# Altium project TRACTIAN.PrjPcb
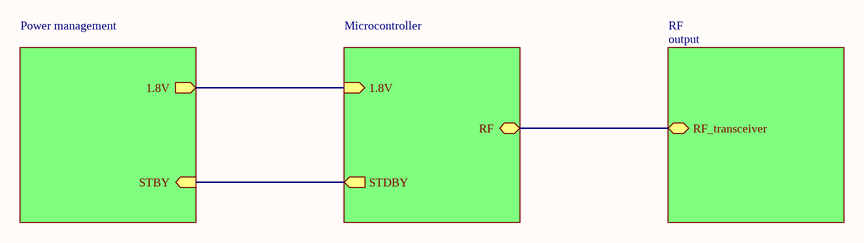
[diagram p0: Overview.SchDoc]
4 sheets, 68 parts. Net scope: hierarchical (ports join the sheet entries above them; power ports are global).
Board file: wifi.PcbDoc
Sheets:
  Overview.SchDoc
    Power management = power_management.SchDoc
    Microcontroller = microcontroller.SchDoc
    RF  = output.SchDoc

## Sheet Overview.SchDoc
size A

### Sub-sheets
Microcontroller = microcontroller: RF (bidir), 1.8V (in), STDBY (out)
Power management = power_management: 1.8V (out), STBY (in)
RF  = output: RF_transceiver (bidir)

### Nets
1.8V: sheet Power management/1.8V, sheet Microcontroller/1.8V
NetFL1_1: sheet Microcontroller/RF, sheet RF /RF_transceiver
NetIC1_6: sheet Power management/STBY, sheet Microcontroller/STDBY

## Sheet power_management.SchDoc
size A2
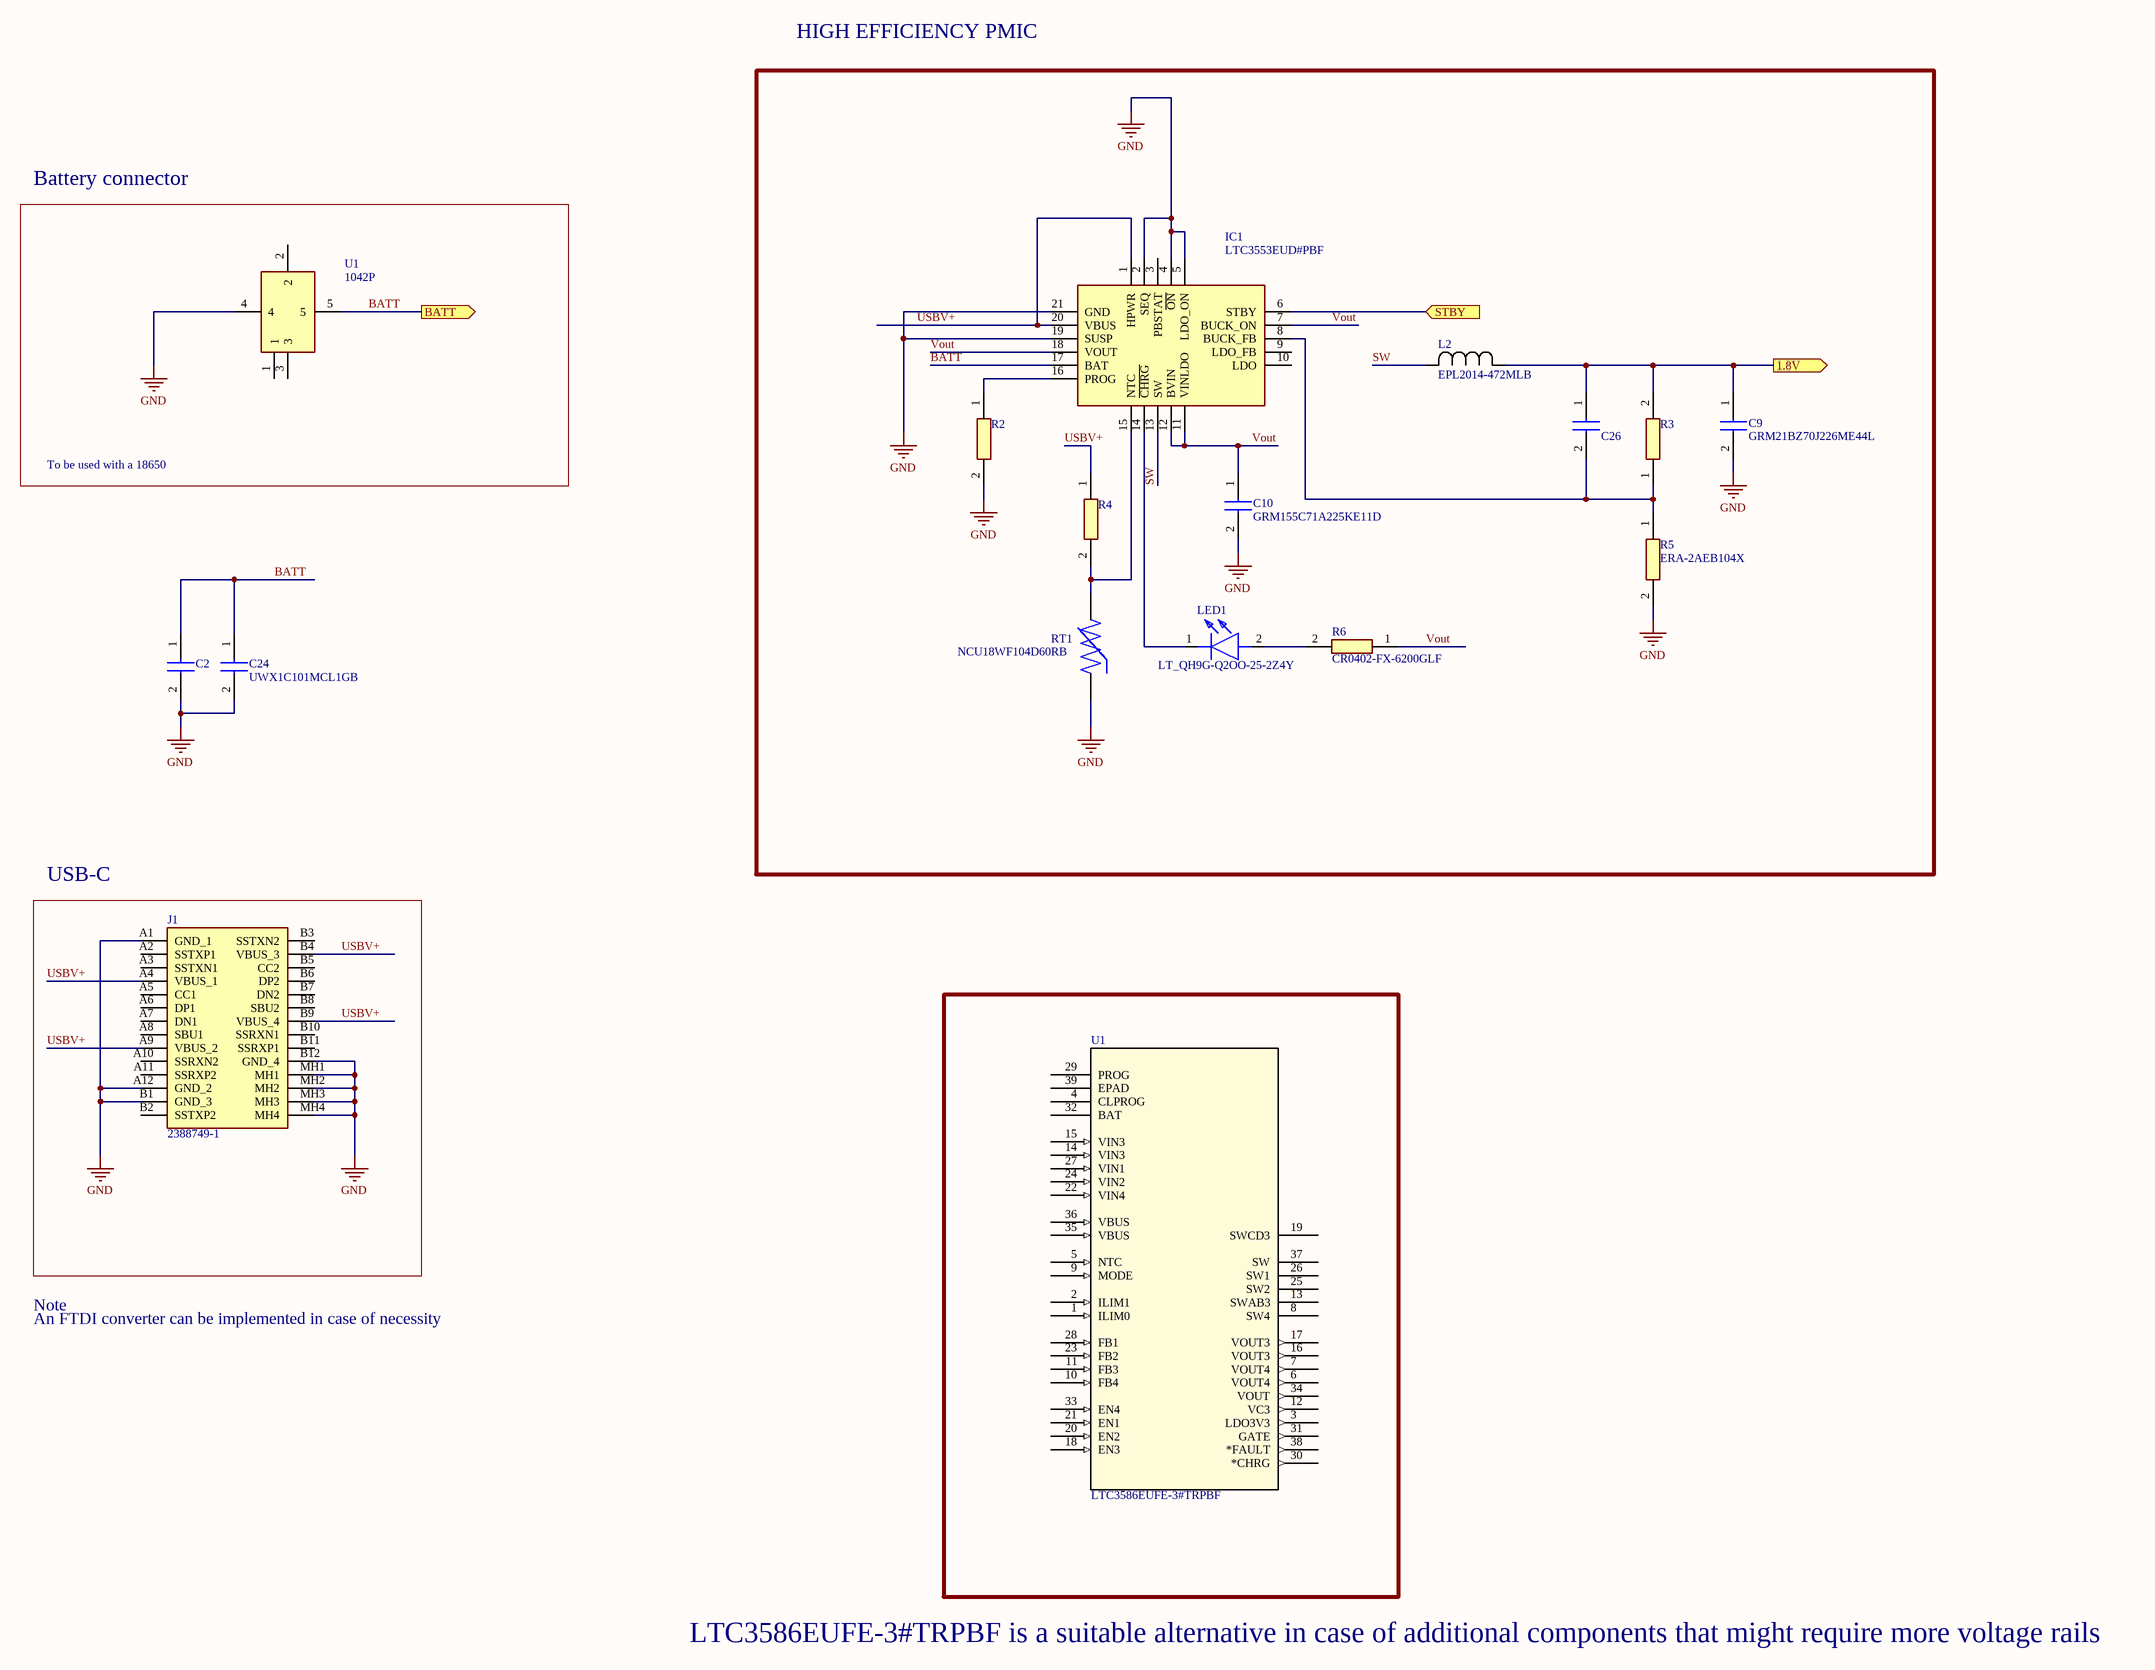
[diagram p1: power_management.SchDoc]

### Parts
(Parts that share a designator on the sheet are numbered #1, #2 ... from top to bottom, then left to right.)
C2  UWX1C101MCL1GB  [WX(6.3)]  (value not drawn)
C9  GRM21BZ70J226ME44L  [CAPC2012X145N]
C10  GRM155C71A225KE11D  [CAPC1005X55N]
C24  UWX1C101MCL1GB  [WX(6.3)]
C26  GRM1555C1H100JA01D  [CAPC1005X55N]  (value not drawn)
IC1  LTC3553EUD#PBF  [QFN40P300X300X80-21N-D]
J1  2388749-1  [23887491]
L2  EPL2014-472MLB  [IND_EPL2014-472MLB_COC]
LED1  LT_QH9G-Q2OO-25-2Z4Y  [LEDC1005X40N]
R2  CR0402-FX-3001GLF  [RESC1005X40N]  (value not drawn)
R3  CPF0402B130KE  [RESC1005X35N]  (value not drawn)
R4  ERJ-2RKF1003X  [ERJ2R_(0402)]  (value not drawn)
R5  ERA-2AEB104X  [ERA2AED122X]
R6  CR0402-FX-6200GLF  [RESC1005X40N]
RT1  NCU18WF104D60RB  [THRMC1608X95N]
U1#1  1042P  [1042P]
U1#2  LTC3586EUFE-3#TRPBF  [QFN-38_UFE_LIT]  (graphical)

### Blocks framed on the sheet
Battery connector: U1#1
USB-C: J1

### Ports
1.8V (out), BATT (out), STBY (in)

### Nets
GND: C2.2(+) C9.2 C10.2 C24.2(+) IC1.2(SEQ) IC1.4(~{ON}) IC1.5(LDO_ON) IC1.19(SUSP) IC1.21(GND) J1.A1(GND_1) J1.A12(GND_2) J1.B1(GND_3) J1.B12(GND_4) J1.MH1 J1.MH2 J1.MH3 J1.MH4 R2.2 R5.2 RT1.1 U1#1.4
1.8V: C9.1 C26.1 L2.1 R3.2 ; port 1.8V
BATT: C2.1(-) C24.1(-) IC1.17(BAT) U1#1.5 ; port BATT
SW: IC1.13(SW) L2.2
USBV+: IC1.1(HPWR) IC1.20(VBUS) J1.A4(VBUS_1) J1.A9(VBUS_2) J1.B4(VBUS_3) J1.B9(VBUS_4) R4.1
Vout: C10.1 IC1.7(BUCK_ON) IC1.11(VINLDO) IC1.12(BVIN) IC1.18(VOUT) R6.1
NetC26_2: C26.2 IC1.8(BUCK_FB) R3.1 R5.1
NetIC1_6: IC1.6(STBY) ; port STBY
NetIC1_14: IC1.14(~{CHRG}) LED1.1(K)
NetIC1_15: IC1.15(NTC) R4.2 RT1.2
NetIC1_16: IC1.16(PROG) R2.1
NetLED1_2: LED1.2(A) R6.2

Not connected (* = marked no-connect by the designer): IC1 3(PBSTAT) 9(LDO_FB) 10(LDO); J1 A2(SSTXP1) A3(SSTXN1) A5(CC1) A6(DP1) A7(DN1) A8(SBU1) A10(SSRXN2) A11(SSRXP2) B2(SSTXP2) B3(SSTXN2) B5(CC2) B6(DP2) B7(DN2) B8(SBU2) B10(SSRXN1) B11(SSRXP1); U1#1 1 2 3; U1#2 1(ILIM0) 2(ILIM1) 3(LDO3V3) 4(CLPROG) 5(NTC) 6(VOUT4) 7(VOUT4) 8(SW4) 9(MODE) 10(FB4) 11(FB3) 12(VC3) 13(SWAB3) 14(VIN3) 15(VIN3) 16(VOUT3) 17(VOUT3) 18(EN3) 19(SWCD3) 20(EN2) 21(EN1) 22(VIN4) 23(FB2) 24(VIN2) 25(SW2) 26(SW1) 27(VIN1) 28(FB1) 29(PROG) 30(*CHRG) 31(GATE) 32(BAT) 33(EN4) 34(VOUT) 35(VBUS) 36(VBUS) 37(SW) 38(*FAULT) 39(EPAD)

### Notes on the sheet
- HIGH EFFICIENCY PMIC
- To be used with a 18650
- An FTDI converter can be implemented in case of necessity
- Note
- LTC3586EUFE-3#TRPBF is a suitable alternative in case of additional components that might require more voltage rails
- Title
- Size:
- Date:
- File:
- A2
- Number:
- Time:
- Revision:
- Sheet
- of

### Library data of the parts
C2 C24 = UWX1C101MCL1GB: Capacitor; Manufacturer_Name: Nichicon; Datasheet Link: https://componentsearchengine.com/Datasheets/2/UWX1C101MCL1GB.pdf; Manufacturer_Part_Number: UWX1C101MCL1GB; Mouser Part Number: 647-UWX1C101MCL1; Mouser Price/Stock: https://www.mouser.co.uk/ProductDetail/Nichicon/UWX1C101MCL1GB?qs=7D1LtPJG0i2nFwCSiru1OQ%3D%3D; Arrow Part Number: UWX1C101MCL1GB; Arrow Price/Stock: https://www.arrow.com/en/products/uwx1c101mcl1gb/nichicon?region=nac
C9 = GRM21BZ70J226ME44L: Capacitor; Manufacturer_Name: Murata Electronics; Datasheet Link: https://datasheet.datasheetarchive.com/originals/distributors/Datasheets_SAMA/f9f842f388215b641c6ec7ec92c93a8d.pdf; Height: 1.45mm; Manufacturer_Part_Number: GRM21BZ70J226ME44L; Mouser Part Number: 81-GRM21BZ70J226ME4L; Mouser Price/Stock: https://www.mouser.co.uk/ProductDetail/Murata-Electronics/GRM21BZ70J226ME44L?qs=gt1LBUVyoHk1niSPiXLfGQ%3D%3D; Arrow Part Number: GRM21BZ70J226ME44L; Arrow Price/Stock: https://www.arrow.com/en/products/grm21bz70j226me44l/murata-manufacturing?region=nac
C10 = GRM155C71A225KE11D: Capacitor; Manufacturer_Name: Murata Electronics; Datasheet Link: https://psearch.en.murata.com/capacitor/product/GRM155C71A225KE11%23.html; Height: 0.55mm; Manufacturer_Part_Number: GRM155C71A225KE11D; Mouser Part Number: 81-GRM155C71A225KE1D; Mouser Price/Stock: https://www.mouser.co.uk/ProductDetail/Murata-Electronics/GRM155C71A225KE11D?qs=hNud%2FORuBR1WTMd%2FnRwa3Q%3D%3D; Arrow Part Number: GRM155C71A225KE11D; Arrow Price/Stock: https://www.arrow.com/en/products/grm155c71a225ke11d/murata-manufacturing?region=nac
C26 = GRM1555C1H100JA01D: Capacitor; Manufacturer_Name: Murata Electronics; Datasheet Link: https://datasheet.datasheetarchive.com/originals/distributors/Datasheets_SAMA/ec4f1577dddcc7a13ddad897a28002d3.pdf; Height: 0.55mm; Manufacturer_Part_Number: GRM1555C1H100JA01D; Mouser Part Number: 81-GRM1555C1H100JA1D; Mouser Price/Stock: https://www.mouser.co.uk/ProductDetail/Murata-Electronics/GRM1555C1H100JA01D?qs=to8XolpOzrNUIL4CZ%252BkORA%3D%3D; Arrow Part Number: GRM1555C1H100JA01D; Arrow Price/Stock: https://www.arrow.com/en/products/grm1555c1h100ja01d/murata-manufacturing
IC1 = LTC3553EUD#PBF: Integrated Circuit; Manufacturer_Name: Analog Devices; Datasheet Link: https://www.mouser.com/datasheet/2/609/3553fc-1270248.pdf; Height: 0.8mm; Manufacturer_Part_Number: LTC3553EUD#PBF; Mouser Part Number: 584-LTC3553EUD#PBF; Mouser Price/Stock: https://www.mouser.co.uk/ProductDetail/Analog-Devices/LTC3553EUDPBF?qs=hVkxg5c3xu%252Bt8tpGZUg1fw%3D%3D; Arrow Part Number: LTC3553EUD#PBF; Arrow Price/Stock: https://www.arrow.com/en/products/ltc3553eudpbf/analog-devices
J1 = 2388749-1: Connector; Manufacturer_Name: TE Connectivity; Datasheet Link: https://www.mouser.de/datasheet/2/418/8/ENG_CD_2388749_1-2492255.pdf; Height: 3.29mm; Manufacturer_Part_Number: 2388749-1; Mouser Part Number: 571-2388749-1; Mouser Price/Stock: https://www.mouser.co.uk/ProductDetail/TE-Connectivity/2388749-1?qs=aP1CjGhiNiHDGRk0QZ2ZCg%3D%3D; Arrow Part Number: 2388749-1; Arrow Price/Stock: https://www.arrow.com/en/products/2388749-1/te-connectivity?region=europe
L2 = EPL2014-472MLB: No Description Available; Mfr_Name: Coilcraft; Type: DEV; Copyright: Copyright (C) 2022 Ultra Librarian. All rights reserved.; Manufacturer_Part_Number: EPL2014-472MLB; RefDes: RefDes
LED1 = LT_QH9G-Q2OO-25-2Z4Y: LED; Manufacturer_Name: OSRAM; Manufacturer_Part_Number: LT QH9G-Q2OO-25-2Z4Y; Datasheet Link: https://dammedia.osram.info/media/resource/hires/osram-dam-5171475/LT%20QH9G_EN.pdf; Height: 0.4mm; Mouser Part Number: 720-LTQH9GQ2S225; Mouser Price/Stock: https://www.mouser.co.uk/ProductDetail/OSRAM-Opto-Semiconductors/LT-QH9G-Q2OO-25-2Z4Y?qs=74fRo9GAWsyBNNbbi2bfww%3D%3D; Arrow Part Number: LT QH9G-Q2OO-25-2Z4Y; Arrow Price/Stock: https://www.arrow.com/en/products/ltqh9g-q2oo-25-2z4y/osram-opto-semiconductors
R2 = CR0402-FX-3001GLF: Resistor; Manufacturer_Name: Bourns; Datasheet Link: https://www.bourns.com/pdfs/CR0402.pdf; Height: 0.4mm; Manufacturer_Part_Number: CR0402-FX-3001GLF; Mouser Part Number: 652-CR0402FX-3001GLF; Mouser Price/Stock: https://www.mouser.co.uk/ProductDetail/Bourns/CR0402-FX-3001GLF?qs=SFHnMgm9IsyiPGXk%2Fs2PYg%3D%3D
R3 = CPF0402B130KE: Resistor; Manufacturer_Name: TE Connectivity; Datasheet Link: http://www.farnell.com/datasheets/1786775.pdf; Height: 0.35mm; Manufacturer_Part_Number: CPF0402B130KE; Mouser Part Number: 279-CPF0402B130KE; Mouser Price/Stock: https://www.mouser.com/Search/Refine.aspx?Keyword=279-CPF0402B130KE
R4 = ERJ-2RKF1003X: Resistor; Manufacturer_Name: Panasonic; Datasheet Link: http://industrial.panasonic.com/cdbs/www-data/pdf/RDA0000/AOA0000C304.pdf; Height: 0.4mm; Manufacturer_Part_Number: ERJ-2RKF1003X; Mouser Part Number: 667-ERJ-2RKF1003X; Mouser Price/Stock: https://www.mouser.co.uk/ProductDetail/Panasonic/ERJ-2RKF1003X?qs=H7k1u0Mp9JQnXoBKdf15Qg%3D%3D; Arrow Part Number: ERJ-2RKF1003X; Arrow Price/Stock: https://www.arrow.com/en/products/erj-2rkf1003x/panasonic?region=nac
R5 = ERA-2AEB104X: Resistor; Manufacturer_Name: Panasonic; Datasheet Link: http://industrial.panasonic.com/cdbs/www-data/pdf/RDM0000/AOA0000C307.pdf; Height: 0.4mm; Manufacturer_Part_Number: ERA-2AEB104X; Mouser Part Number: 667-ERA-2AEB104X; Mouser Price/Stock: https://www.mouser.co.uk/ProductDetail/Panasonic/ERA-2AEB104X?qs=YFwoyZoVY0jijibKYIWHHg%3D%3D; Arrow Part Number: ERA-2AEB104X; Arrow Price/Stock: https://www.arrow.com/en/products/era-2aeb104x/panasonic
R6 = CR0402-FX-6200GLF: Resistor; Manufacturer_Name: Bourns; Datasheet Link: https://www.bourns.com/pdfs/CR0402.pdf; Height: 0.4mm; Manufacturer_Part_Number: CR0402-FX-6200GLF; Mouser Part Number: 652-CR0402FX-6200GLF; Mouser Price/Stock: https://www.mouser.co.uk/ProductDetail/Bourns/CR0402-FX-6200GLF?qs=ePR1ZvdkOKK%252BzBZSL76wNw%3D%3D; Arrow Part Number: CR0402-FX-6200GLF; Arrow Price/Stock: https://www.arrow.com/en/products/cr0402-fx-6200glf/bourns?region=nac
RT1 = NCU18WF104D60RB: NTC Thermistor 100k 0603 (1608 Metric); MF: Murata; Package: 1608 Murata; MP: NCU18WF104D60RB; Check_prices: https://www.snapeda.com/parts/NCU18WF104D60RB/Murata/view-part/1297311/?ref=eda; Digi-Key_Part_Number: 490-18157-1-ND; Purchase-URL: https://pricing.snapeda.com/search/part/NCU18WF104D60RB/?ref=eda; Value: *; SnapEDA_Link: https://www.snapeda.com/parts/NCU18WF104D60RB/Murata/view-part/1297311/?ref=snap
U1#1 = 1042P: Undefined or Miscellaneous; Manufacturer_Name: Keystone Electronics; Datasheet Link: http://www.keyelco.com/product-pdf.cfm?p=13957; Height: 14mm; Manufacturer_Part_Number: 1042P; Mouser Part Number: 534-1042P; Mouser Price/Stock: https://www.mouser.co.uk/ProductDetail/Keystone-Electronics/1042P?qs=g2rIOKKlpoboHyq0g1zn1A%3D%3D; Arrow Part Number: 1042P; Arrow Price/Stock: https://www.arrow.com/en/products/1042p/keystone-electronics?region=europe
U1#2 = LTC3586EUFE-3#TRPBF: No Description Available; Mfr_Name: Analog Devices Inc; Copyright: Copyright (C) 2022 Ultra Librarian. All rights reserved.; Manufacturer_Part_Number: LTC3586EUFE-3#TRPBF; RefDes: RefDes; Type: DEV

## Sheet microcontroller.SchDoc
size A2
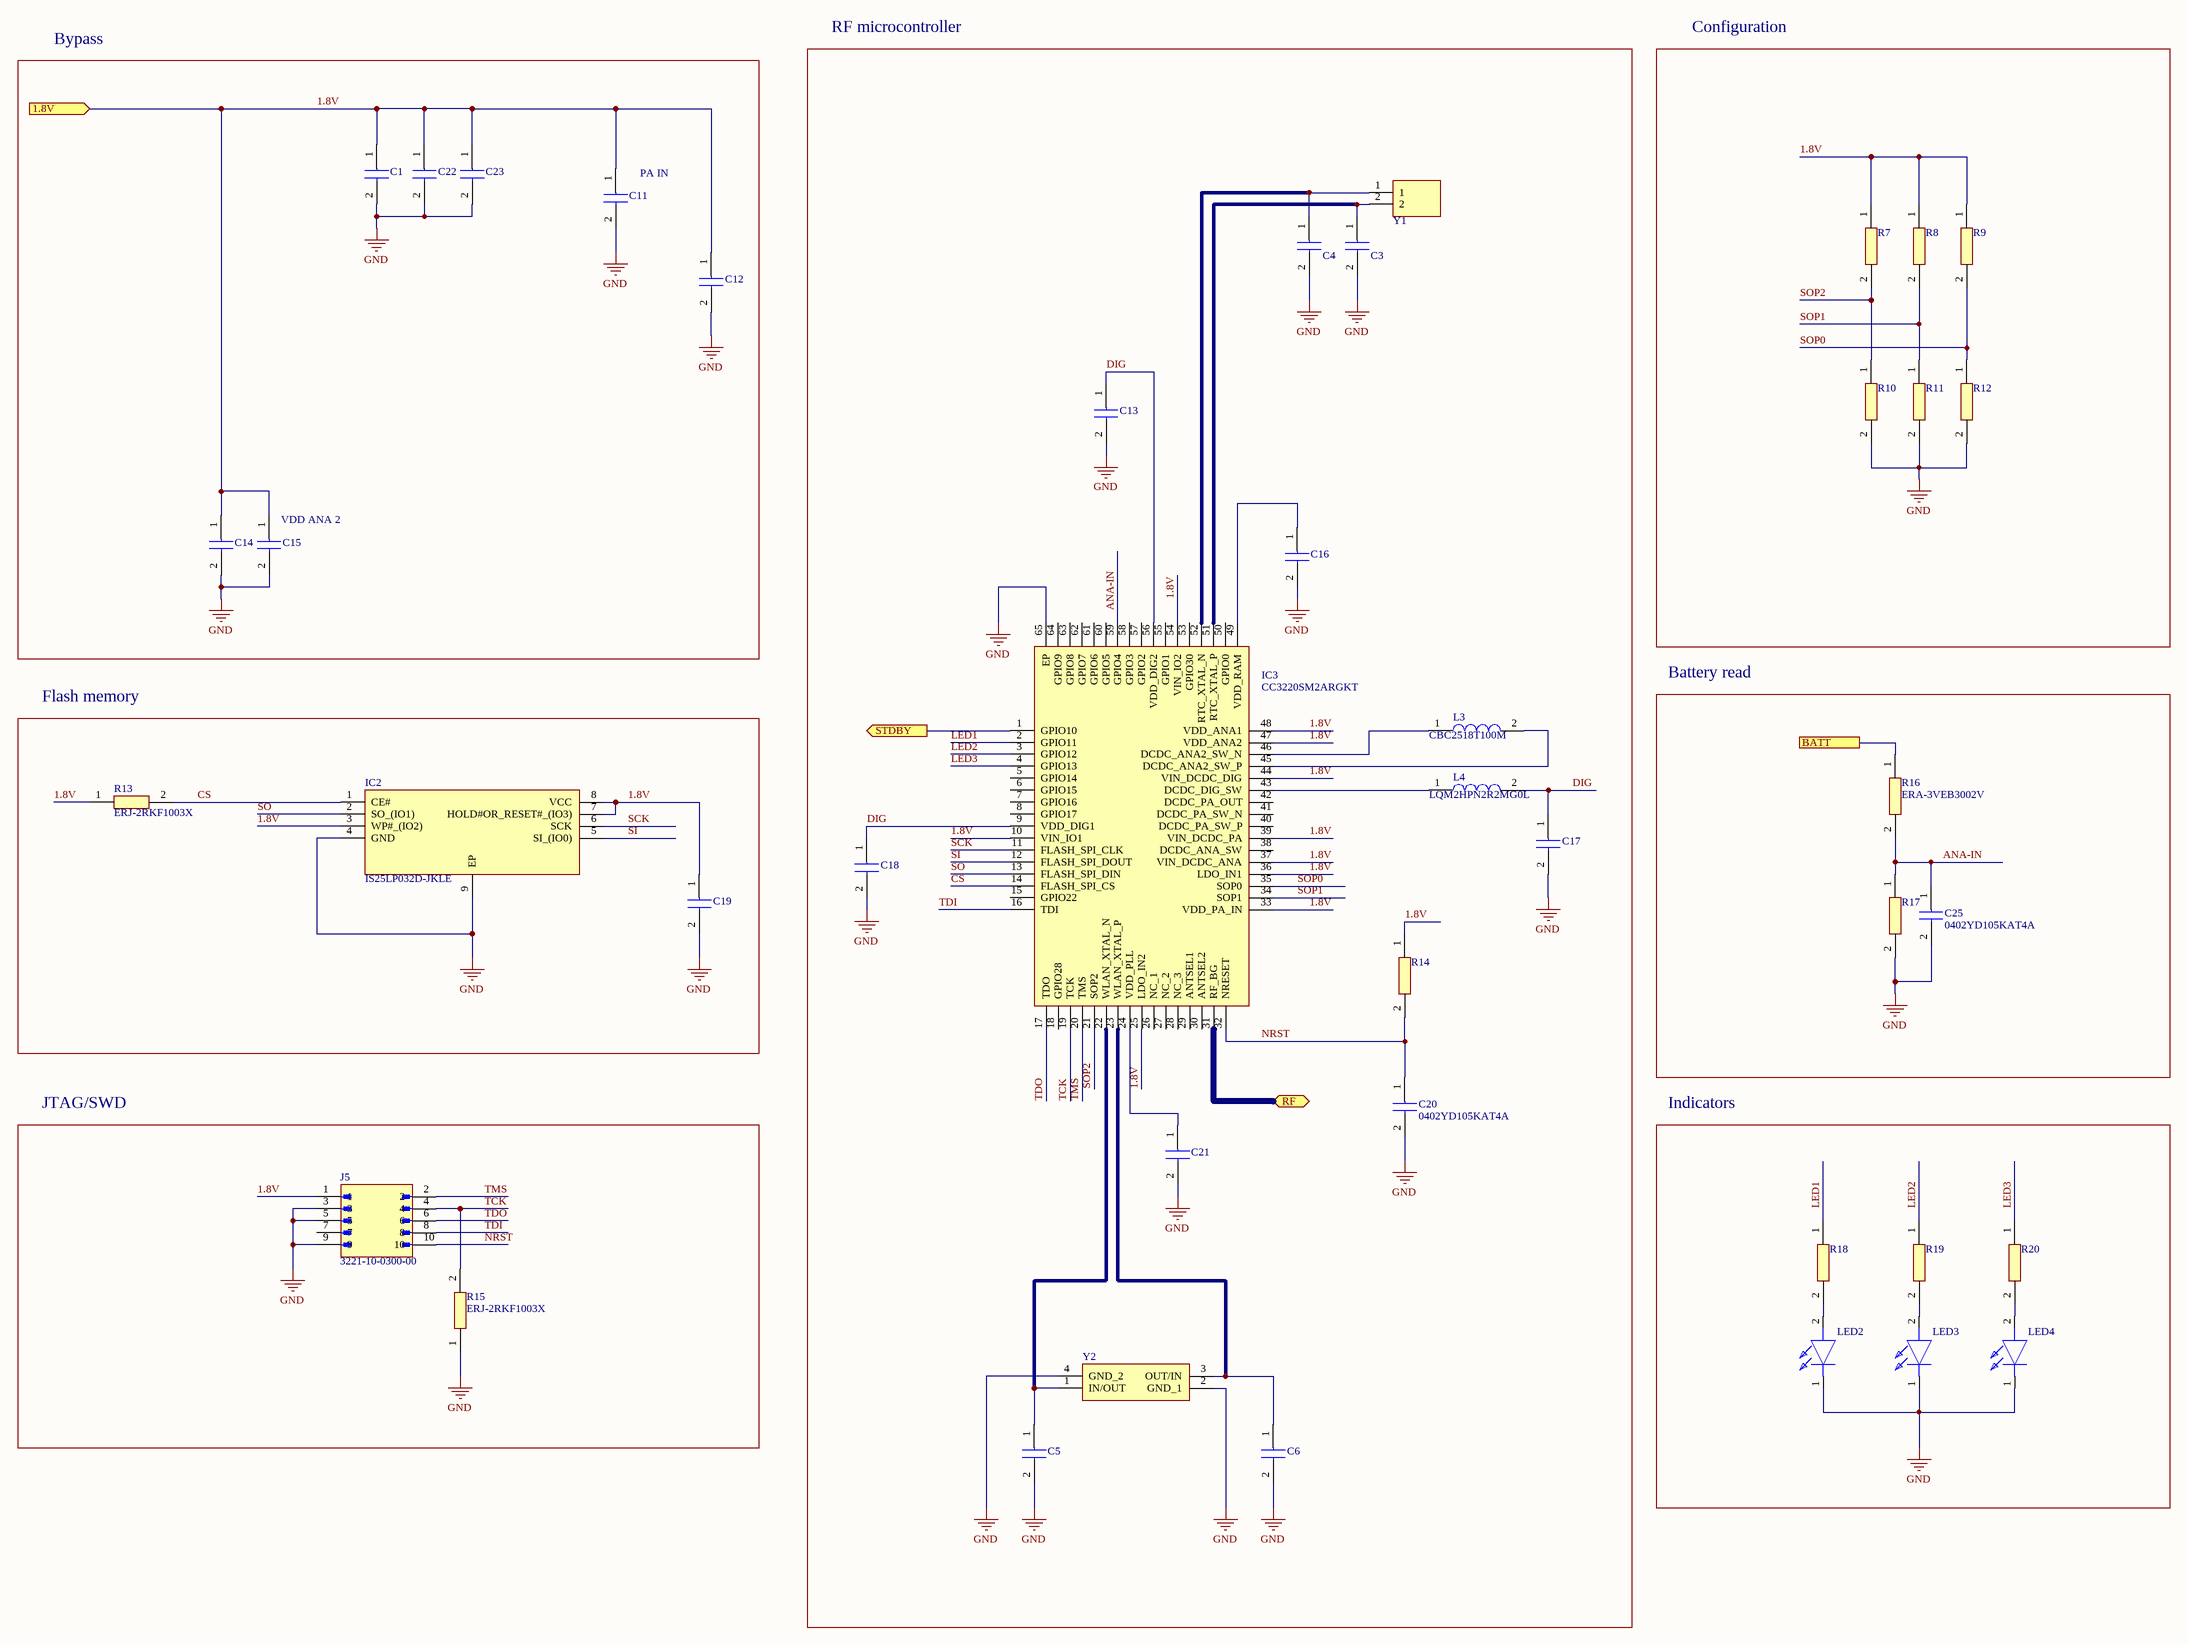
[diagram p2: microcontroller.SchDoc]

### Parts
C1  C1005X5R0J475M050BC  [C1005_Commercial]  (value not drawn)
C3  GRM1555C1H100JA01D  [CAPC1005X55N]  (value not drawn)
C4  GRM1555C1H100JA01D  [CAPC1005X55N]  (value not drawn)
C5  GRM1555C1H6R2CA01D  [CAPC1005X55N]  (value not drawn)
C6  GRM1555C1H6R2CA01D  [CAPC1005X55N]  (value not drawn)
C11  GRM158R60J226ME01D  [CAPC1005X80N]  (value not drawn)
C12  0402YD105KAT4A  [CAPC1005X56N]  (value not drawn)
C13  C1005X7R1C104K050BC  [C1005_Commercial]  (value not drawn)
C14  GRM155C80G106ME44D  [CAPC1005X55N]  (value not drawn)
C15  GRM155C80G106ME44D  [CAPC1005X55N]  (value not drawn)
C16  C1005X7R1C104K050BC  [C1005_Commercial]  (value not drawn)
C17  GRM155C80G106ME44D  [CAPC1005X55N]  (value not drawn)
C18  C1005X7R1C104K050BC  [C1005_Commercial]  (value not drawn)
C19  C1005X7R1C104K050BC  [C1005_Commercial]  (value not drawn)
C20  0402YD105KAT4A  [CAPC1005X56N]
C21  C1005X7R1C104K050BC  [C1005_Commercial]  (value not drawn)
C22  C1005X5R0J475M050BC  [C1005_Commercial]  (value not drawn)
C23  C1005X5R0J475M050BC  [C1005_Commercial]  (value not drawn)
C25  0402YD105KAT4A  [CAPC1005X56N]
IC2  IS25LP032D-JKLE  [SON127P600X500X80-9N-D]
IC3  CC3220SM2ARGKT  [QFN50P900X900X100-65N-D]
J5  3221-10-0300-00  [CNC_3221-10-0300-00]
L3  CBC2518T100M  [INDC2518X180N]
L4  LQM2HPN2R2MG0L  [INDC2520X100N]
LED2  LT_QH9G-Q2OO-25-2Z4Y  [LEDC1005X40N]  (value not drawn)
LED3  LT_QH9G-Q2OO-25-2Z4Y  [LEDC1005X40N]  (value not drawn)
LED4  LT_QH9G-Q2OO-25-2Z4Y  [LEDC1005X40N]  (value not drawn)
R7  ERJ-2RKF1003X  [ERJ2R_(0402)]  (value not drawn)
R8  ERJ-2RKF1003X  [ERJ2R_(0402)]  (value not drawn)
R9  ERJ-2RKF1003X  [ERJ2R_(0402)]  (value not drawn)
R10  ERJ-2RKF1003X  [ERJ2R_(0402)]  (value not drawn)
R11  ERJ-2RKF1003X  [ERJ2R_(0402)]  (value not drawn)
R12  ERJ-2RKF1003X  [ERJ2R_(0402)]  (value not drawn)
R13  ERJ-2RKF1003X  [ERJ2R_(0402)]
R14  ERJ-2RKF1003X  [ERJ2R_(0402)]  (value not drawn)
R15  ERJ-2RKF1003X  [ERJ2R_(0402)]
R16  ERA-3VEB3002V  [ERA3KV_(0603)]
R17  RT0603BRD0750KL  [RESC1608X55N]  (value not drawn)
R18  CR0402-FX-6200GLF  [RESC1005X40N]  (value not drawn)
R19  CR0402-FX-6200GLF  [RESC1005X40N]  (value not drawn)
R20  CR0402-FX-6200GLF  [RESC1005X40N]  (value not drawn)
Y1  ABS07-32.768KHZ-9-T  [ABS-07]  (value not drawn)
Y2  ECS-400-8-36B-7KY-TR  [ECS400836B7KYTR]  (value not drawn)

### Blocks framed on the sheet
Bypass: C1 C11 C12 C14 C15 C22 C23
RF microcontroller: C3-C6 C13 C16-C18 C20 C21 IC3 L3 L4 R14 Y1 Y2
Configuration: R7-R12
Battery read: C25 R16 R17
Flash memory: C19 IC2 R13
JTAG/SWD: J5 R15
Indicators: LED2-LED4 R18-R20

### Ports
1.8V (in), BATT, RF (bidir), STDBY (out)

### Nets
GND: C1.2 C3.2 C4.2 C5.2 C6.2 C11.2 C12.2 C13.2 C14.2 C15.2 C16.2 C17.2 C18.2 C19.2 C20.2 C21.2 C22.2 C23.2 C25.2 IC2.4(GND) IC2.9(EP) IC3.65(EP) J5.3 J5.5 J5.9 LED2.1(K) LED3.1(K) LED4.1(K) R10.2 R11.2 R12.2 R15.1 R17.2 Y2.2(GND_1) Y2.4(GND_2)
1.8V: C1.1 C11.1 C12.1 C14.1 C15.1 C19.1 C22.1 C23.1 IC2.3(WP#_(IO2)) IC2.7(HOLD#OR_RESET#_(IO3)) IC2.8(VCC) IC3.10(VIN_IO1) IC3.25(LDO_IN2) IC3.33(VDD_PA_IN) IC3.36(LDO_IN1) IC3.37(VIN_DCDC_ANA) IC3.39(VIN_DCDC_PA) IC3.44(VIN_DCDC_DIG) IC3.47(VDD_ANA2) IC3.48(VDD_ANA1) IC3.54(VIN_IO2) J5.1 R7.1 R8.1 R9.1 R13.1 R14.1 ; port 1.8V
ANA-IN: C25.1 IC3.59(GPIO4) R16.2 R17.1
CS: IC2.1(CE#) IC3.14(FLASH_SPI_CS) R13.2
DIG: C13.1 C17.1 C18.1 IC3.9(VDD_DIG1) IC3.56(VDD_DIG2) L4.2
LED1: IC3.2(GPIO11) R18.1
LED2: IC3.3(GPIO12) R19.1
LED3: IC3.4(GPIO13) R20.1
NRST: C20.1 IC3.32(NRESET) J5.10 R14.2
SCK: IC2.6(SCK) IC3.11(FLASH_SPI_CLK)
SI: IC2.5(SI_(IO0)) IC3.12(FLASH_SPI_DOUT)
SO: IC2.2(SO_(IO1)) IC3.13(FLASH_SPI_DIN)
SOP0: IC3.35(SOP0) R9.2 R12.1
SOP1: IC3.34(SOP1) R8.2 R11.1
SOP2: IC3.21(SOP2) R7.2 R10.1
TCK: IC3.19(TCK) J5.4 R15.2
TDI: IC3.16(TDI) J5.8
TDO: IC3.17(TDO) J5.6
TMS: IC3.20(TMS) J5.2
NetC3_1: C3.1 IC3.51(RTC_XTAL_P) Y1.2
NetC4_1: C4.1 IC3.52(RTC_XTAL_N) Y1.1
NetC5_1: C5.1 IC3.22(WLAN_XTAL_N) Y2.1(IN/OUT)
NetC6_1: C6.1 IC3.23(WLAN_XTAL_P) Y2.3(OUT/IN)
NetC16_1: C16.1 IC3.49(VDD_RAM)
NetC21_1: C21.1 IC3.24(VDD_PLL)
NetFL1_1: IC3.31(RF_BG) ; port RF
NetIC1_6: IC3.1(GPIO10) ; port STDBY
NetIC3_43: IC3.43(DCDC_DIG_SW) L4.1
NetIC3_45: IC3.45(DCDC_ANA2_SW_P) L3.2
NetIC3_46: IC3.46(DCDC_ANA2_SW_N) L3.1
NetLED2_2: LED2.2(A) R18.2
NetLED3_2: LED3.2(A) R19.2
NetLED4_2: LED4.2(A) R20.2
NetR16_1: R16.1 ; port BATT

Not connected (* = marked no-connect by the designer): IC3 5(GPIO14) 6(GPIO15) 7(GPIO16) 8(GPIO17) 15(GPIO22) 18(GPIO28) 26(NC_1) 27(NC_2) 28(NC_3) 29(ANTSEL1) 30(ANTSEL2) 38(DCDC_ANA_SW) 40(DCDC_PA_SW_P) 41(DCDC_PA_SW_N) 42(DCDC_PA_OUT) 50(GPIO0) 53(GPIO30) 55(GPIO1) 57(GPIO2) 58(GPIO3) 60(GPIO5) 61(GPIO6) 62(GPIO7) 63(GPIO8) 64(GPIO9); J5 7

### Notes on the sheet
- (near C11) PA IN
- (near C15) VDD ANA 2
- Title
- Size:
- Date:
- File:
- A2
- Number:
- Time:
- Revision:
- Sheet
- of

### Library data of the parts
C1 C22 C23 = C1005X5R0J475M050BC: Capacitor; Manufacturer_Name: TDK; Datasheet Link: https://product.tdk.com/system/files/dam/doc/product/capacitor/ceramic/mlcc/catalog/mlcc_commercial_general_en.pdf; Height: 0.55mm; Manufacturer_Part_Number: C1005X5R0J475M050BC; Mouser Part Number: 810-C1005X5R0J475M; Mouser Price/Stock: https://www.mouser.co.uk/ProductDetail/TDK/C1005X5R0J475M050BC?qs=NRhsANhppD%2Fq1XiyABABNQ%3D%3D; Arrow Part Number: C1005X5R0J475M050BC; Arrow Price/Stock: https://www.arrow.com/en/products/c1005x5r0j475m050bc/tdk
C3 C4 = GRM1555C1H100JA01D: as C26 on sheet power_management; Datasheet Link: https://datasheet.datasheetarchive.com/originals/distributors/Datasheets_SAMA/ec4f1577dddcc7a13ddad897a28002d3.pdf; Height: 0.55mm; Manufacturer_Part_Number: GRM1555C1H100JA01D; Mouser Part Number: 81-GRM1555C1H100JA1D; Mouser Price/Stock: https://www.mouser.co.uk/ProductDetail/Murata-Electronics/GRM1555C1H100JA01D?qs=to8XolpOzrNUIL4CZ%252BkORA%3D%3D; Arrow Part Number: GRM1555C1H100JA01D; Arrow Price/Stock: https://www.arrow.com/en/products/grm1555c1h100ja01d/murata-manufacturing
C5 C6 = GRM1555C1H6R2CA01D: Capacitor; Manufacturer_Name: Murata Electronics; Datasheet Link: https://datasheet.datasheetarchive.com/originals/distributors/Datasheets_SAMA/ec4f1577dddcc7a13ddad897a28002d3.pdf; Height: 0.55mm; Manufacturer_Part_Number: GRM1555C1H6R2CA01D; Mouser Part Number: 81-GRM1555C1H6R2CA1D; Mouser Price/Stock: https://www.mouser.co.uk/ProductDetail/Murata-Electronics/GRM1555C1H6R2CA01D?qs=e%252BE4OD6MgMdxw4b5lMPkpQ%3D%3D; Arrow Part Number: GRM1555C1H6R2CA01D; Arrow Price/Stock: https://www.arrow.com/en/products/grm1555c1h6r2ca01d/murata-manufacturing?region=nac
C11 = GRM158R60J226ME01D: Capacitor; Manufacturer_Name: Murata Electronics; Datasheet Link: https://search.murata.co.jp/Ceramy/image/img/A01X/G101/ENG/GRM158R60J226ME01-01A.pdf; Height: 0.8mm; Manufacturer_Part_Number: GRM158R60J226ME01D; Mouser Part Number: 81-GRM158R60J226ME1D; Mouser Price/Stock: https://www.mouser.co.uk/ProductDetail/Murata-Electronics/GRM158R60J226ME01D?qs=hd1VzrDQEGhRlVgN8RQ1oA%3D%3D; Arrow Part Number: GRM158R60J226ME01D; Arrow Price/Stock: https://www.arrow.com/en/products/grm158r60j226me01d/murata-manufacturing?region=europe
C12 C20 C25 = 0402YD105KAT4A: Capacitor; Manufacturer_Name: AVX; Datasheet Link: https://datasheet.datasheetarchive.com/originals/dk/DKDS40/DSANUWW008853.pdf; Height: 0.56mm; Manufacturer_Part_Number: 0402YD105KAT4A; Mouser Part Number: 581-0402YD105KAT4A; Mouser Price/Stock: https://www.mouser.co.uk/ProductDetail/AVX/0402YD105KAT4A?qs=mQP6vorrPAd40YYIeuHDNw%3D%3D
C13 C16 C18 C19 C21 = C1005X7R1C104K050BC: Capacitor; Manufacturer_Name: TDK; Datasheet Link: https://product.tdk.com/system/files/dam/doc/product/capacitor/ceramic/mlcc/catalog/mlcc_commercial_general_en.pdf; Height: 0.55mm; Manufacturer_Part_Number: C1005X7R1C104K050BC; Mouser Part Number: 810-C1005X7R1C104K; Mouser Price/Stock: https://www.mouser.co.uk/ProductDetail/TDK/C1005X7R1C104K050BC?qs=NRhsANhppD%252BhAGOapA8QKQ%3D%3D; Arrow Part Number: C1005X7R1C104K050BC; Arrow Price/Stock: https://www.arrow.com/en/products/c1005x7r1c104k050bc/tdk?region=nac
C14 C15 C17 = GRM155C80G106ME44D: Capacitor; Manufacturer_Name: Murata Electronics; Height: 0.55mm; Manufacturer_Part_Number: GRM155C80G106ME44D; Mouser Part Number: 81-GRM155C80G106ME44; Mouser Price/Stock: https://www.mouser.co.uk/ProductDetail/Murata-Electronics/GRM155C80G106ME44D?qs=T3oQrply3y9851rB85WA8A%3D%3D
IC2 = IS25LP032D-JKLE: Integrated Circuit; Manufacturer_Name: Integrated Silicon Solution Inc.; Datasheet Link: https://www.arrow.com/en/products/is25lp032d-jkle/integrated-silicon-solution-inc?region=nac; Height: 0.8mm; Manufacturer_Part_Number: IS25LP032D-JKLE; Mouser Part Number: 870-IS25LP032D-JKLE; Mouser Price/Stock: https://www.mouser.co.uk/ProductDetail/ISSI/IS25LP032D-JKLE?qs=DXv0QSHKF4y5hGfg2Mzxpw%3D%3D; Arrow Part Number: IS25LP032D-JKLE; Arrow Price/Stock: https://www.arrow.com/en/products/is25lp032d-jkle/integrated-silicon-solution-inc?region=nac
IC3 = CC3220SM2ARGKT: Integrated Circuit; Manufacturer_Name: Texas Instruments; Datasheet Link: https://www.ti.com/lit/gpn/CC3220S; Height: 1mm; Manufacturer_Part_Number: CC3220SM2ARGKT; Mouser Part Number: 595-CC3220SM2ARGKT; Mouser Price/Stock: https://www.mouser.co.uk/ProductDetail/Texas-Instruments/CC3220SM2ARGKT/?qs=Mv7BduZupUjdsZg3%2FQIrGA%3D%3D; Arrow Part Number: CC3220SM2ARGKT; Arrow Price/Stock: https://www.arrow.com/en/products/cc3220sm2argkt/texas-instruments
J5 = 3221-10-0300-00: Connector Header Surface Mount 10 position 0.050 (1.27mm); MF: CNC Tech; Package: None; Check_prices: https://www.snapeda.com/parts/3221-10-0300-00/CNC+Tech/view-part/?ref=eda; Value: *; MP: 3221-10-0300-00; Availability: In Stock; Purchase-URL: https://pricing.snapeda.com/search/part/3221-10-0300-00/?ref=eda; SnapEDA_Link: https://www.snapeda.com/parts/3221-10-0300-00/CNC+Tech/view-part/?ref=snap; Price: None
L3 = CBC2518T100M: Inductor; Manufacturer_Name: TAIYO YUDEN; Datasheet Link: https://componentsearchengine.com/Datasheets/2/CBC2518T100M.pdf; Height: 1.8mm; Manufacturer_Part_Number: CBC2518T100M; Mouser Part Number: 963-CBC2518T100M; Mouser Price/Stock: https://www.mouser.co.uk/ProductDetail/Taiyo-Yuden/CBC2518T100M?qs=I6KAKw0tg2xfOZzcznL4uQ%3D%3D; Arrow Part Number: CBC2518T100M; Arrow Price/Stock: https://www.arrow.com/en/products/cbc2518t100m/taiyo-yuden
L4 = LQM2HPN2R2MG0L: Inductor; Manufacturer_Name: Murata Electronics; Datasheet Link: https://search.murata.co.jp/Ceramy/image/img/P02/JELF243B-0019.pdf; Height: 1mm; Manufacturer_Part_Number: LQM2HPN2R2MG0L; Mouser Part Number: 81-LQM2HPN2R2MG0L; Mouser Price/Stock: https://www.mouser.co.uk/ProductDetail/Murata-Electronics/LQM2HPN2R2MG0L?qs=%2F%252BYoplLUB5jZYKbM2SoJpQ%3D%3D; Arrow Part Number: LQM2HPN2R2MG0L; Arrow Price/Stock: https://www.arrow.com/en/products/lqm2hpn2r2mg0l/murata-manufacturing
LED2-LED4 = LT_QH9G-Q2OO-25-2Z4Y: as LED1 on sheet power_management; Datasheet Link: https://dammedia.osram.info/media/resource/hires/osram-dam-5171475/LT%20QH9G_EN.pdf; Height: 0.4mm; Mouser Part Number: 720-LTQH9GQ2S225; Mouser Price/Stock: https://www.mouser.co.uk/ProductDetail/OSRAM-Opto-Semiconductors/LT-QH9G-Q2OO-25-2Z4Y?qs=74fRo9GAWsyBNNbbi2bfww%3D%3D; Arrow Part Number: LT QH9G-Q2OO-25-2Z4Y; Arrow Price/Stock: https://www.arrow.com/en/products/ltqh9g-q2oo-25-2z4y/osram-opto-semiconductors
R7-R15 = ERJ-2RKF1003X: Resistor; Manufacturer_Name: Panasonic; Datasheet Link: http://industrial.panasonic.com/cdbs/www-data/pdf/RDA0000/AOA0000C304.pdf; Height: 0.4mm; Manufacturer_Part_Number: ERJ-2RKF1003X; Mouser Part Number: 667-ERJ-2RKF1003X; Mouser Price/Stock: https://www.mouser.co.uk/ProductDetail/Panasonic/ERJ-2RKF1003X?qs=H7k1u0Mp9JQnXoBKdf15Qg%3D%3D; Arrow Part Number: ERJ-2RKF1003X; Arrow Price/Stock: https://www.arrow.com/en/products/erj-2rkf1003x/panasonic?region=nac
R16 = ERA-3VEB3002V: Resistor; Manufacturer_Name: Panasonic; Datasheet Link: http://industrial.panasonic.com/cdbs/www-data/pdf/RDM0000/RDM0000C331.pdf; Height: 0.4mm; Manufacturer_Part_Number: ERA-3VEB3002V; Mouser Part Number: 667-ERA-3VEB3002V; Mouser Price/Stock: https://www.mouser.co.uk/ProductDetail/Panasonic/ERA-3VEB3002V?qs=OlC7AqGiEDlbfxcRQEdT8g%3D%3D
R17 = RT0603BRD0750KL: Resistor; Manufacturer_Name: KEMET; Datasheet Link: https://mouser.componentsearchengine.com/Datasheets/1/RT0603BRD0750KL.pdf; Height: 0.55mm; Manufacturer_Part_Number: RT0603BRD0750KL; Mouser Part Number: 603-RT0603BRD0750KL; Mouser Price/Stock: https://www.mouser.co.uk/ProductDetail/YAGEO/RT0603BRD0750KL?qs=qpJ%252B%252B%252Bdg6p2%2FJCmrad8NSA%3D%3D; Arrow Part Number: RT0603BRD0750KL; Arrow Price/Stock: https://www.arrow.com/en/products/rt0603brd0750kl/yageo
R18-R20 = CR0402-FX-6200GLF: Resistor; Manufacturer_Name: Bourns; Datasheet Link: https://www.bourns.com/pdfs/CR0402.pdf; Height: 0.4mm; Manufacturer_Part_Number: CR0402-FX-6200GLF; Mouser Part Number: 652-CR0402FX-6200GLF; Mouser Price/Stock: https://www.mouser.co.uk/ProductDetail/Bourns/CR0402-FX-6200GLF?qs=ePR1ZvdkOKK%252BzBZSL76wNw%3D%3D; Arrow Part Number: CR0402-FX-6200GLF; Arrow Price/Stock: https://www.arrow.com/en/products/cr0402-fx-6200glf/bourns?region=nac
Y1 = ABS07-32.768KHZ-9-T: Integrated Circuit; Manufacturer_Name: ABRACON; Datasheet Link: http://www.abracon.com/Resonators/ABS07.pdf; Manufacturer_Part_Number: ABS07-32.768KHZ-9-T; Mouser Part Number: 815-ABS07-32.768K9T; Mouser Price/Stock: https://www.mouser.co.uk/ProductDetail/ABRACON/ABS07-32.768KHZ-9-T?qs=2nyfZ6BV3ogTQgR0mYqaug%3D%3D; Arrow Part Number: ABS07-32.768KHZ-9-T; Arrow Price/Stock: https://www.arrow.com/en/products/abs07-32.768khz-9-t/abracon?region=europe
Y2 = ECS-400-8-36B-7KY-TR: Crystal or Oscillator; Manufacturer_Name: ECS; Datasheet Link: https://ecsxtal.com/store/pdf/ECX-2236B.pdf; Height: 0.6mm; Manufacturer_Part_Number: ECS-400-8-36B-7KY-TR

## Sheet output.SchDoc
size A3
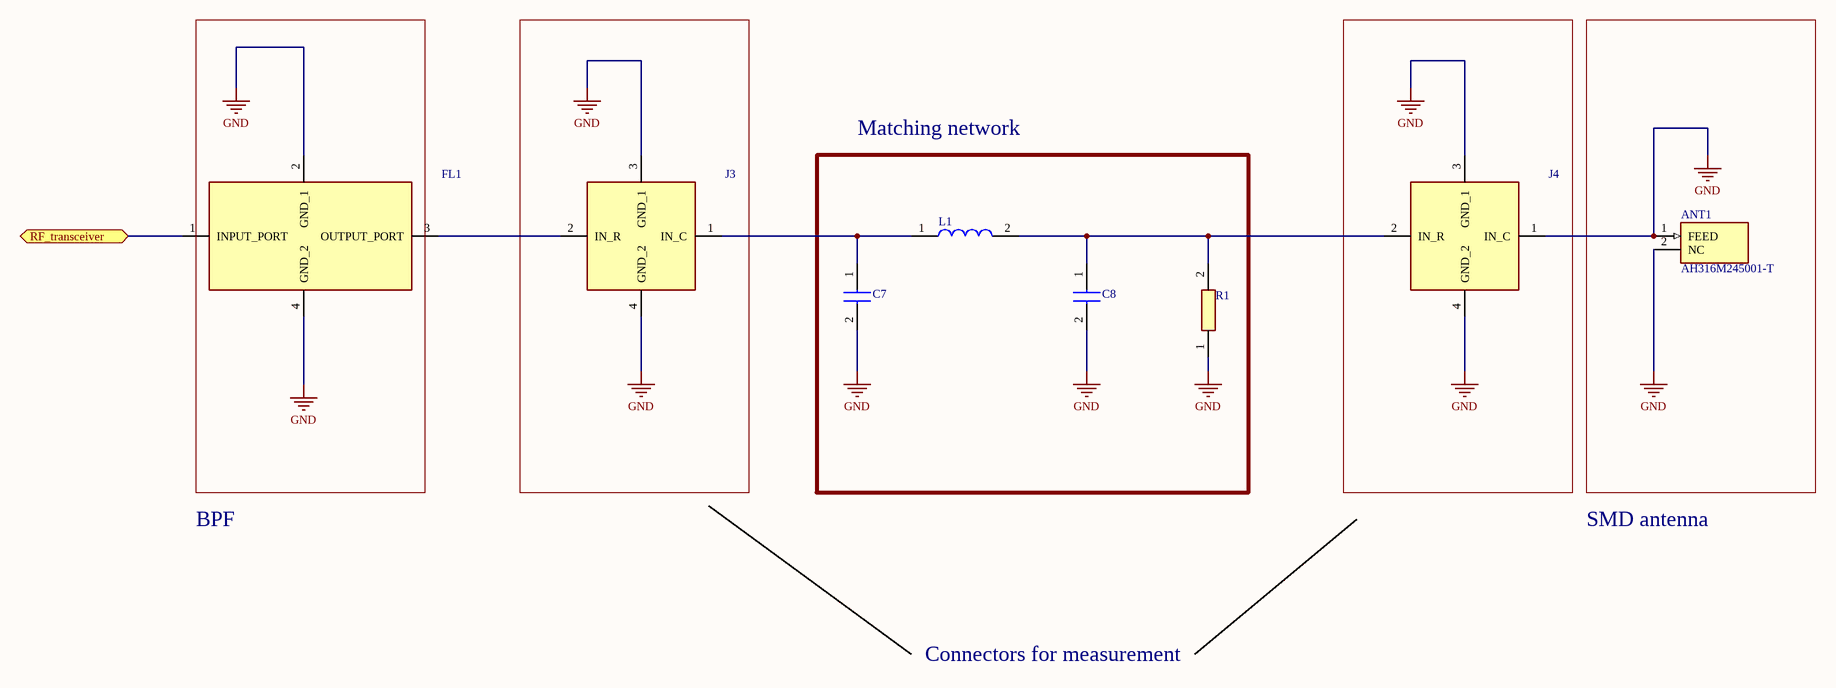
[diagram p3: output.SchDoc]

### Parts
ANT1  AH316M245001-T  [ANTC3216X60N]
C7  GRM1555C1HR50BA01D  [CAPC1005X55N]  (value not drawn)
C8  GRM1555C1HR50BA01D  [CAPC1005X55N]  (value not drawn)
FL1  DEA202450BT-1294D1-H  [DEA202450BT1294D1H]  (value not drawn)
J3  MM8030-2610RJ3  [MM80302610RJ3]  (value not drawn)
J4  MM8030-2610RJ3  [MM80302610RJ3]  (value not drawn)
L1  LQG15HS3N3S02D  [LQG15WH0N7B02D]  (value not drawn)
R1  CH0402-50RGFPT  [RESC1006X63N]  (value not drawn)

### Blocks framed on the sheet
Matching network: C7 C8 L1 R1

### Ports
RF_transceiver (bidir)

### Nets
GND: ANT1.1(FEED) ANT1.2(NC) C7.2 C8.2 FL1.2(GND_1) FL1.4(GND_2) J3.3(GND_1) J3.4(GND_2) J4.1(IN_C) J4.3(GND_1) J4.4(GND_2) R1.1
NetC7_1: C7.1 J3.1(IN_C) L1.1
NetC8_1: C8.1 J4.2(IN_R) L1.2 R1.2
NetFL1_1: FL1.1(INPUT_PORT) ; port RF_transceiver
NetFL1_3: FL1.3(OUTPUT_PORT) J3.2(IN_R)

### Notes on the sheet
- BPF
- SMD antenna
- Connectors for measurement
- Title
- Size:
- Date:
- A3
- Number:
- Time:
- Revision:
- Sheet
- of
- File:

### Library data of the parts
ANT1 = AH316M245001-T: Antenna; Manufacturer_Name: TAIYO YUDEN; Datasheet Link: http://www.mouser.com/ds/2/396/chipantenna01_e-587795.pdf; Height: 0.6mm; Manufacturer_Part_Number: AH316M245001-T; Mouser Part Number: 963-AH316M245001-T; Mouser Price/Stock: https://www.mouser.co.uk/ProductDetail/Taiyo-Yuden/AH316M245001-T?qs=I6KAKw0tg2zXv3bNBw9dFQ%3D%3D
C7 C8 = GRM1555C1HR50BA01D: Capacitor; Manufacturer_Name: Murata Electronics; Datasheet Link: https://datasheet.datasheetarchive.com/originals/distributors/Datasheets_SAMA/ec4f1577dddcc7a13ddad897a28002d3.pdf; Height: 0.55mm; Manufacturer_Part_Number: GRM1555C1HR50BA01D; Mouser Part Number: 81-GRM1555C1HR50BA1D; Mouser Price/Stock: https://www.mouser.co.uk/ProductDetail/Murata-Electronics/GRM1555C1HR50BA01D?qs=e%252BE4OD6MgMeKFfJD3AEN3Q%3D%3D; Arrow Part Number: GRM1555C1HR50BA01D; Arrow Price/Stock: https://www.arrow.com/en/products/grm1555c1hr50ba01d/murata-manufacturing
FL1 = DEA202450BT-1294D1-H: Filter; Manufacturer_Name: TDK; Datasheet Link: https://www.mouser.com/catalog/specsheets/TDK_DEA202450BT_1294D1_H_ver1_0.pdf; Height: 0.8mm; Manufacturer_Part_Number: DEA202450BT-1294D1-H; Mouser Part Number: 810-DEA202450BT1294D; Mouser Price/Stock: https://www.mouser.co.uk/ProductDetail/TDK/DEA202450BT-1294D1-H?qs=W%2FMpXkg%252BdQ4stfqD0qqbsg%3D%3D
J3 J4 = MM8030-2610RJ3: Connector; Manufacturer_Name: Murata Electronics; Datasheet Link: https://componentsearchengine.com//MM8030-2610RJ3.pdf; Height: 1mm; Mouser2 Part Number: 81-MM8030-2610RJ3; Mouser2 Price/Stock: https://www.mouser.com/Search/Refine.aspx?Keyword=81-MM8030-2610RJ3; Manufacturer_Part_Number: MM8030-2610RJ3
L1 = LQG15HS3N3S02D: Inductor; Manufacturer_Name: Murata Electronics; Datasheet Link: https://psearch.en.murata.com/inductor/product/LQG15HS3N3S02%23.html; Height: 0.55mm; Manufacturer_Part_Number: LQG15HS3N3S02D; Mouser Part Number: 81-LQG15HS3N3S02D; Mouser Price/Stock: https://www.mouser.co.uk/ProductDetail/Murata-Electronics/LQG15HS3N3S02D?qs=ctz47l0uL1AsjFUyMRD%2FGA%3D%3D; Arrow Part Number: LQG15HS3N3S02D; Arrow Price/Stock: https://www.arrow.com/en/products/lqg15hs3n3s02d/murata-manufacturing?region=nac
R1 = CH0402-50RGFPT: Resistor; Manufacturer_Name: Vishay; Datasheet Link: http://www.vishay.com/docs/53014/ch.pdf; Height: 0.627mm; Manufacturer_Part_Number: CH0402-50RGFPT; Mouser Part Number: 71-CH0402-50RGFPT; Mouser Price/Stock: https://www.mouser.co.uk/ProductDetail/Vishay-Sfernice/CH0402-50RGFPT?qs=zR8VgEwoOb306akMd%2FOkng%3D%3D; Arrow Part Number: CH0402-50RGFPT; Arrow Price/Stock: https://www.arrow.com/en/products/ch0402-50rgfpt/vishay

## Nets that join several sheets
GND: power_management (21 pins), microcontroller (35 pins), output (12 pins)
1.8V: power_management (C9.1 C26.1 L2.1 R3.2), microcontroller (27 pins)
NetFL1_1: microcontroller (IC3.31), output (FL1.1)
NetIC1_6: power_management (IC1.6), microcontroller (IC3.1)